# Altium project BKN-3.PrjPcb
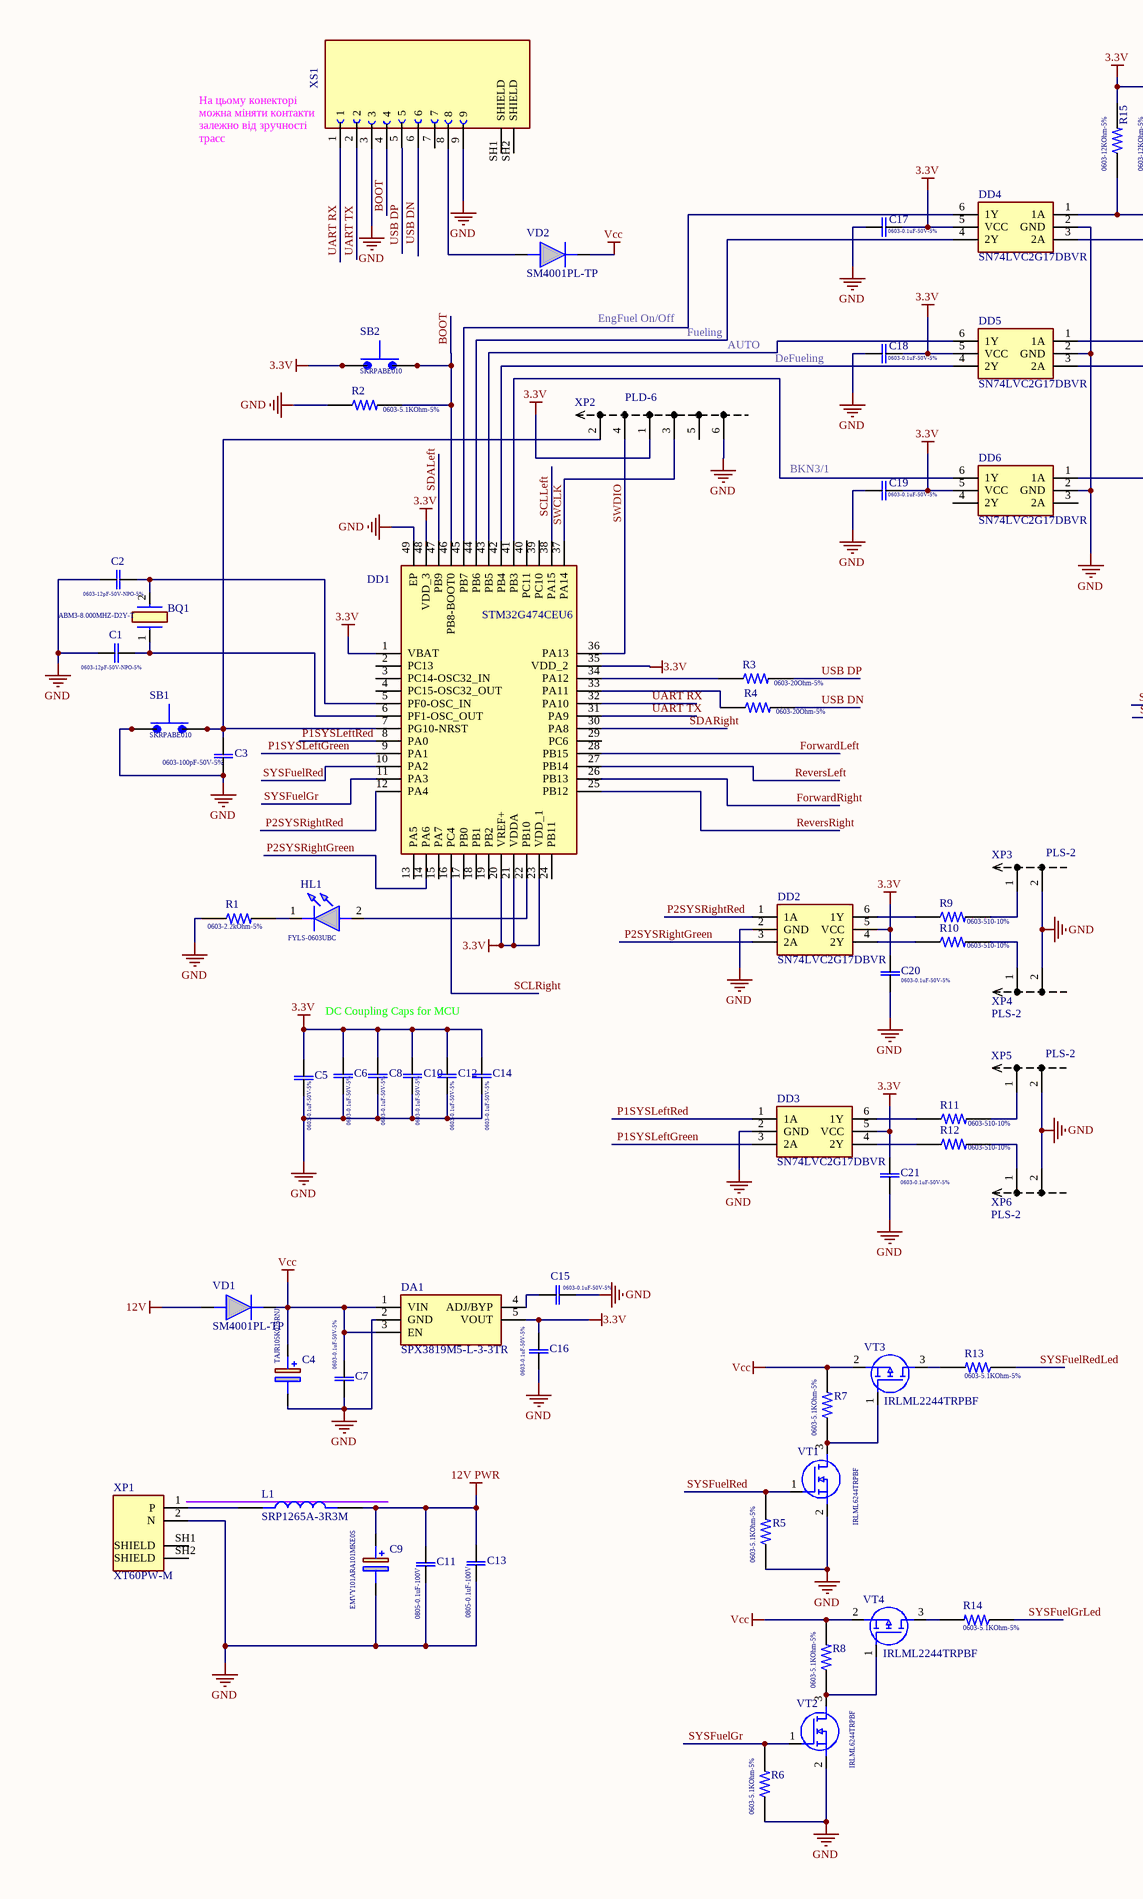
[diagram p0: BKN-3.SchDoc, left]
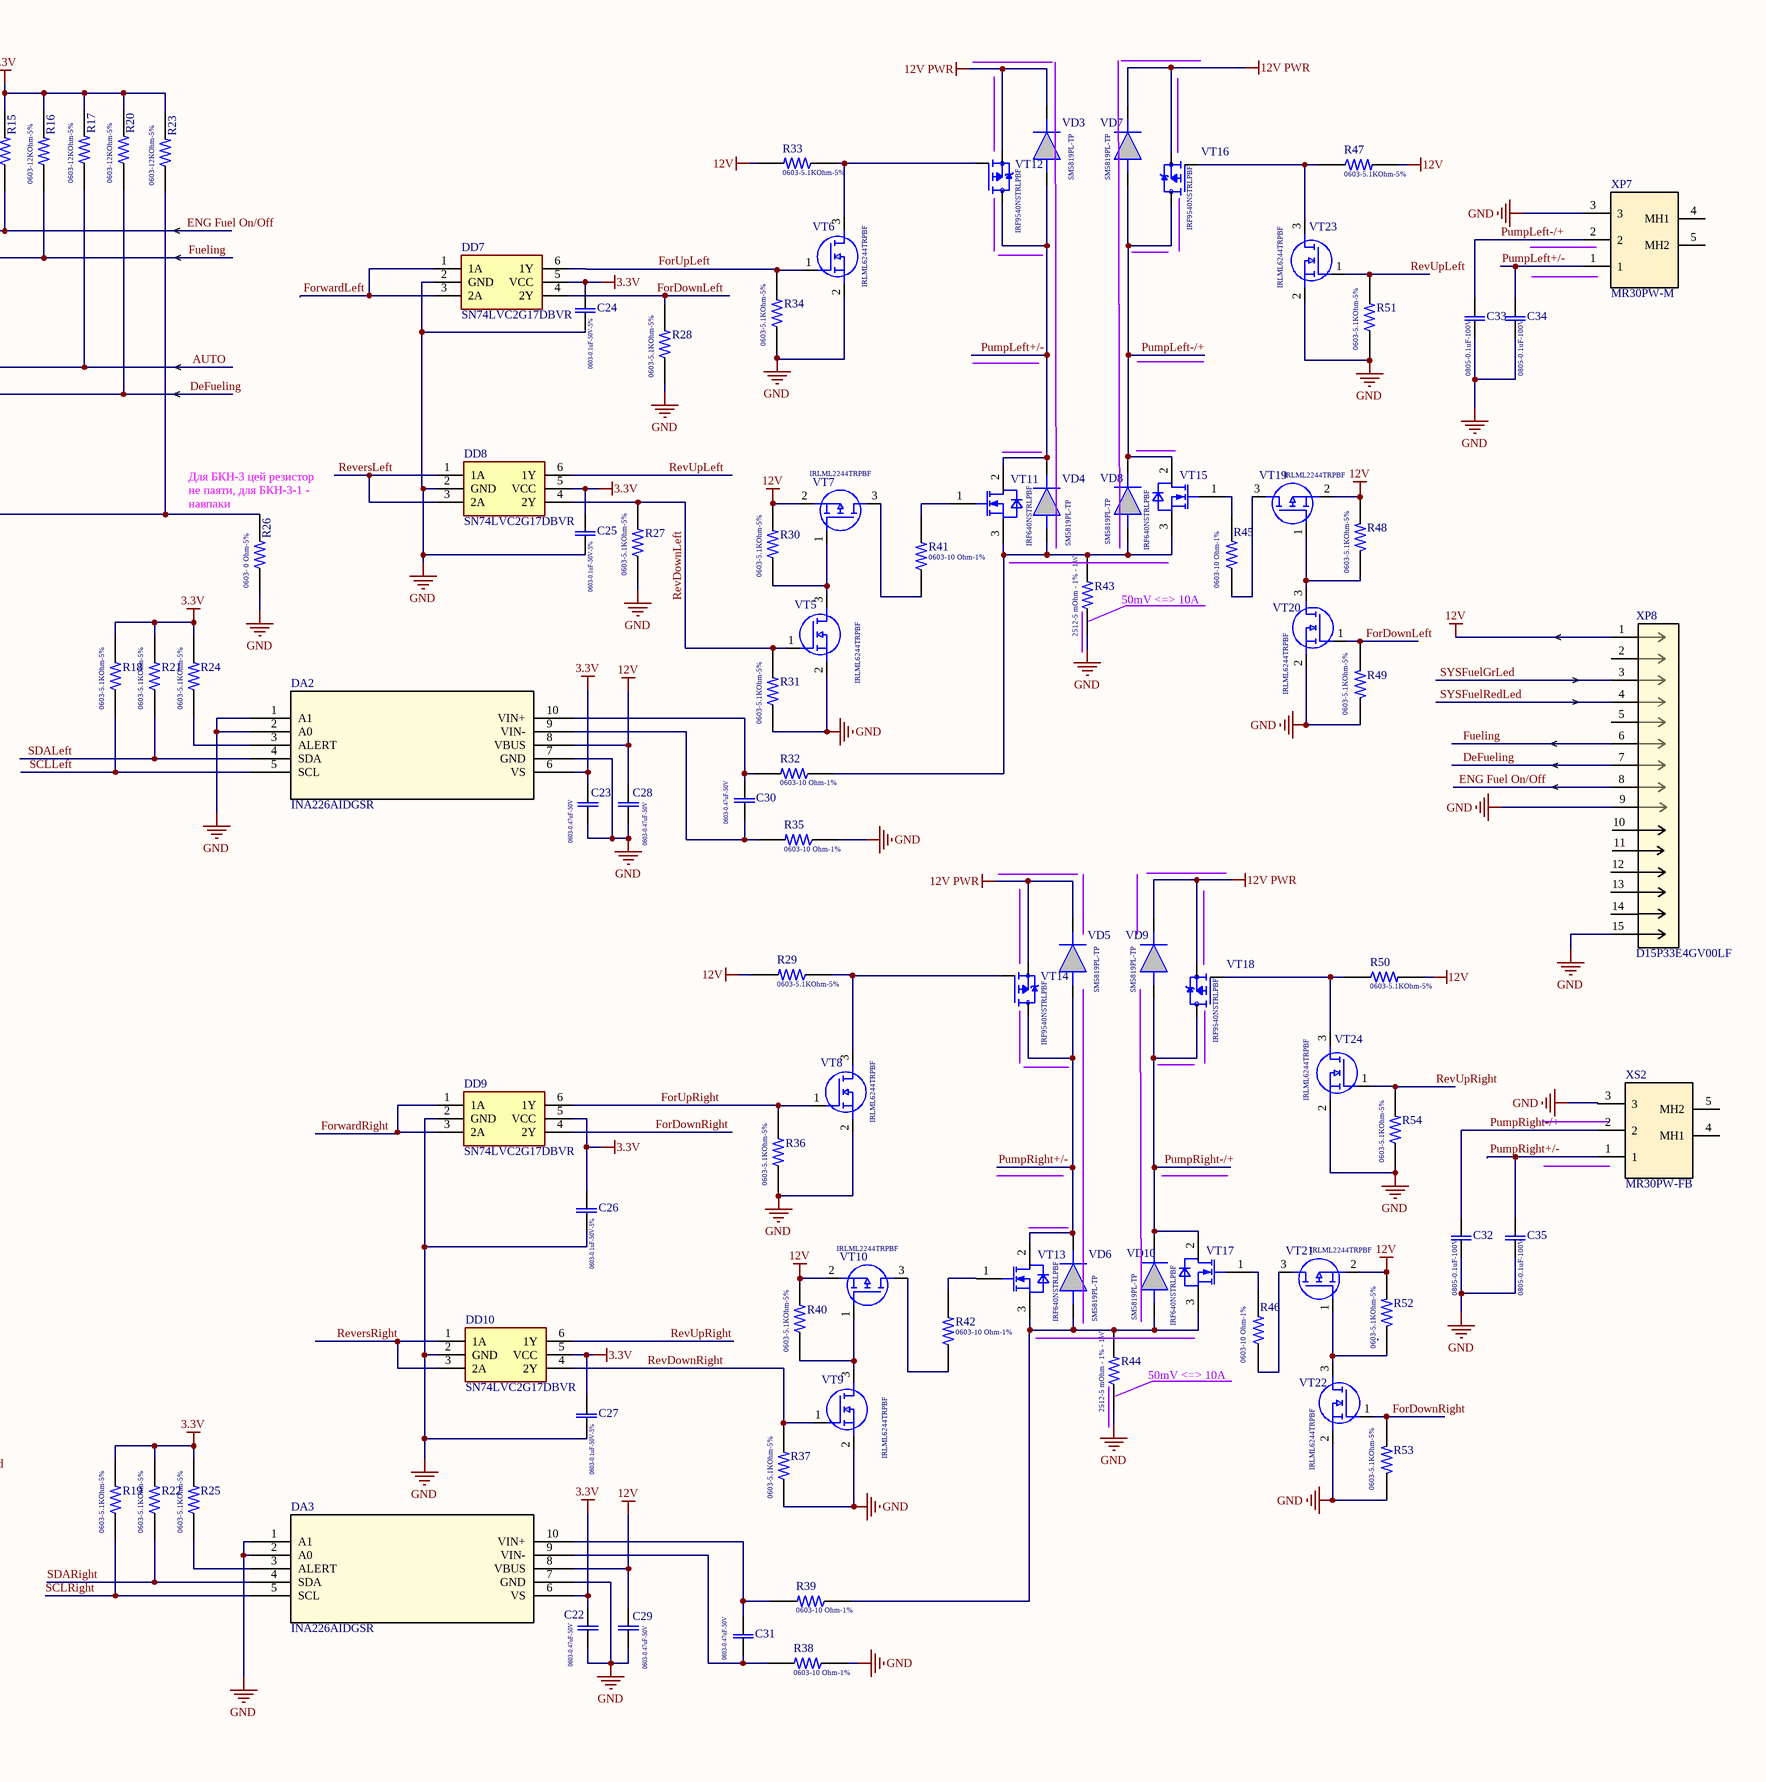
[diagram p1: BKN-3.SchDoc, right]
1 sheet, 151 parts. Net scope: global (net labels, ports and power ports of the same name join across sheets).
Board file: BKN-3.PcbDoc

## Sheet BKN-3.SchDoc
size A2

### Parts
BQ1  ABM3-8.000MHZ-D2Y-T  [ABM3-25.000MHz]
C1  0603-12pF-50V-NPO-5%  [C0603]
C2  0603-12pF-50V-NPO-5%  [C0603]
C3  0603-100pF-50V-5%  [C0603]
C4  TAJR105K025RNJ  [TAJR105K025RNJ]
C5  0603-0.1uF-50V-5%  [C0603]
C6  0603-0.1uF-50V-5%  [C0603]
C7  0603-0.1uF-50V-5%  [C0603]
C8  0603-0.1uF-50V-5%  [C0603]
C9  EMVY101ARA101MKE0S  [EMVY101ARA101MKE0S]
C10  0603-0.1uF-50V-5%  [C0603]
C11  0805-0.1uF-100V  [Cap0805]
C12  0603-0.1uF-50V-5%  [C0603]
C13  0805-0.1uF-100V  [Cap0805]
C14  0603-0.1uF-50V-5%  [C0603]
C15  0603-0.1uF-50V-5%  [C0603]
C16  0603-0.1uF-50V-5%  [C0603]
C17  0603-0.1uF-50V-5%  [C0603]
C18  0603-0.1uF-50V-5%  [C0603]
C19  0603-0.1uF-50V-5%  [C0603]
C20  0603-0.1uF-50V-5%  [C0603]
C21  0603-0.1uF-50V-5%  [C0603]
C22  0603-0.47uF-50V  [C0603]
C23  0603-0.47uF-50V  [C0603]
C24  0603-0.1uF-50V-5%  [C0603]
C25  0603-0.1uF-50V-5%  [C0603]
C26  0603-0.1uF-50V-5%  [C0603]
C27  0603-0.1uF-50V-5%  [C0603]
C28  0603-0.47uF-50V  [C0603]
C29  0603-0.47uF-50V  [C0603]
C30  0603-0.47uF-50V  [C0603]
C31  0603-0.47uF-50V  [C0603]
C32  0805-0.1uF-100V  [Cap0805]
C33  0805-0.1uF-100V  [Cap0805]
C34  0805-0.1uF-100V  [Cap0805]
C35  0805-0.1uF-100V  [Cap0805]
DA1  SPX3819M5-L-3-3TR  [SOT95P280x145-5N]
DA2  INA226AIDGSR  [INA226AIDGSR]
DA3  INA226AIDGSR  [INA226AIDGSR]
DD1  STM32G474CEU6  [QFN50P700X700X60-49N-D]
DD2  SN74LVC2G17DBVR  [SOT95P280x145-6N]
DD3  SN74LVC2G17DBVR  [SOT95P280x145-6N]
DD4  SN74LVC2G17DBVR  [SOT95P280x145-6N]
DD5  SN74LVC2G17DBVR  [SOT95P280x145-6N]
DD6  SN74LVC2G17DBVR  [SOT95P280x145-6N]
DD7  SN74LVC2G17DBVR  [SOT95P280x145-6N]
DD8  SN74LVC2G17DBVR  [SOT95P280x145-6N]
DD9  SN74LVC2G17DBVR  [SOT95P280x145-6N]
DD10  SN74LVC2G17DBVR  [SOT95P280x145-6N]
HL1  FYLS-0603UBC  [LED0603]
L1  SRP1265A-3R3M  [SRP1265A-3R3M]
R1  0603-2.2kOhm-5%  [Res0603]
R2  0603-5.1KOhm-5%  [Res0603]
R3  0603-20Ohm-5%  [Res0603]
R4  0603-20Ohm-5%  [Res0603]
R5  0603-5.1KOhm-5%  [Res0603]
R6  0603-5.1KOhm-5%  [Res0603]
R7  0603-5.1KOhm-5%  [Res0603]
R8  0603-5.1KOhm-5%  [Res0603]
R9  0603-510-10%  [Res0603]
R10  0603-510-10%  [Res0603]
R11  0603-510-10%  [Res0603]
R12  0603-510-10%  [Res0603]
R13  0603-5.1KOhm-5%  [Res0603]
R14  0603-5.1KOhm-5%  [Res0603]
R15  0603-12KOhm-5%  [Res0603]
R16  0603-12KOhm-5%  [Res0603]
R17  0603-12KOhm-5%  [Res0603]
R18  0603-5.1KOhm-5%  [Res0603]
R19  0603-5.1KOhm-5%  [Res0603]
R20  0603-12KOhm-5%  [Res0603]
R21  0603-5.1KOhm-5%  [Res0603]
R22  0603-5.1KOhm-5%  [Res0603]
R23  0603-12KOhm-5%  [Res0603]
R24  0603-5.1KOhm-5%  [Res0603]
R25  0603-5.1KOhm-5%  [Res0603]
R26  0603- 0 Ohm-5%  [Res0603]
R27  0603-5.1KOhm-5%  [Res0603]
R28  0603-5.1KOhm-5%  [Res0603]
R29  0603-5.1KOhm-5%  [Res0603]
R30  0603-5.1KOhm-5%  [Res0603]
R31  0603-5.1KOhm-5%  [Res0603]
R32  0603-10 Ohm-1%  [Res0603]
R33  0603-5.1KOhm-5%  [Res0603]
R34  0603-5.1KOhm-5%  [Res0603]
R35  0603-10 Ohm-1%  [Res0603]
R36  0603-5.1KOhm-5%  [Res0603]
R37  0603-5.1KOhm-5%  [Res0603]
R38  0603-10 Ohm-1%  [Res0603]
R39  0603-10 Ohm-1%  [Res0603]
R40  0603-5.1KOhm-5%  [Res0603]
R41  0603-10 Ohm-1%  [Res0603]
R42  0603-10 Ohm-1%  [Res0603]
R43  2512-5 mOhm - 1% - 1W  [Res2512]
R44  2512-5 mOhm - 1% - 1W  [Res2512]
R45  0603-10 Ohm-1%  [Res0603]
R46  0603-10 Ohm-1%  [Res0603]
R47  0603-5.1KOhm-5%  [Res0603]
R48  0603-5.1KOhm-5%  [Res0603]
R49  0603-5.1KOhm-5%  [Res0603]
R50  0603-5.1KOhm-5%  [Res0603]
R51  0603-5.1KOhm-5%  [Res0603]
R52  0603-5.1KOhm-5%  [Res0603]
R53  0603-5.1KOhm-5%  [Res0603]
R54  0603-5.1KOhm-5%  [Res0603]
SB1  SKRPABE010  [SKRPABE010]
SB2  SKRPABE010  [SKRPABE010]
VD1  SM4001PL-TP  [SODFL3716X120N]
VD2  SM4001PL-TP  [SODFL3716X120N]
VD3  SM5819PL-TP  [SM5819PL-TP (SOD123)]
VD4  SM5819PL-TP  [SM5819PL-TP (SOD123)]
VD5  SM5819PL-TP  [SM5819PL-TP (SOD123)]
VD6  SM5819PL-TP  [SM5819PL-TP (SOD123)]
VD7  SM5819PL-TP  [SM5819PL-TP (SOD123)]
VD8  SM5819PL-TP  [SM5819PL-TP (SOD123)]
VD9  SM5819PL-TP  [SM5819PL-TP (SOD123)]
VD10  SM5819PL-TP  [SM5819PL-TP (SOD123)]
VT1  IRLML6244TRPBF  [SOT95P230x110-3N]
VT2  IRLML6244TRPBF  [SOT95P230x110-3N]
VT3  IRLML2244TRPBF  [SOT95P237x112-3N]
VT4  IRLML2244TRPBF  [SOT95P237x112-3N]
VT5  IRLML6244TRPBF  [SOT95P230x110-3N]
VT6  IRLML6244TRPBF  [SOT95P230x110-3N]
VT7  IRLML2244TRPBF  [SOT95P237x112-3N]
VT8  IRLML6244TRPBF  [SOT95P230x110-3N]
VT9  IRLML6244TRPBF  [SOT95P230x110-3N]
VT10  IRLML2244TRPBF  [SOT95P237x112-3N]
VT11  IRF640NSTRLPBF  [IRF640NSTRLPBF]
VT12  IRF9540NSTRLPBF  [IRF9540NSTRLPBF]
VT13  IRF640NSTRLPBF  [IRF640NSTRLPBF]
VT14  IRF9540NSTRLPBF  [IRF9540NSTRLPBF]
VT15  IRF640NSTRLPBF  [IRF640NSTRLPBF]
VT16  IRF9540NSTRLPBF  [IRF9540NSTRLPBF]
VT17  IRF640NSTRLPBF  [IRF640NSTRLPBF]
VT18  IRF9540NSTRLPBF  [IRF9540NSTRLPBF]
VT19  IRLML2244TRPBF  [SOT95P237x112-3N]
VT20  IRLML6244TRPBF  [SOT95P230x110-3N]
VT21  IRLML2244TRPBF  [SOT95P237x112-3N]
VT22  IRLML6244TRPBF  [SOT95P230x110-3N]
VT23  IRLML6244TRPBF  [SOT95P230x110-3N]
VT24  IRLML6244TRPBF  [SOT95P230x110-3N]
XP1  XT60PW-M  [XT60PW-M]
XP2  PLD-6  [PLD-6]
XP3  PLS-2  [PLS-2]
XP4  PLS-2  [PLS-2]
XP5  PLS-2  [PLS-2]
XP6  PLS-2  [PLS-2]
XP7  MR30PW-M  [MR30PW-M]
XP8  D15P33E4GV00LF  [D15P33E4GV00LF (Amphenol)]
XS1  AMPHENOL_LD09S33E4GV00LF (DB9 ThrHole Right Receptacle )  [AMPHENOL_LD09S33E4GV00LF (9pin receptacle)]  (value not drawn)
XS2  MR30PW-FB  [MR30PW-FB]

### Nets
3.3V: C5.2 C6.2 C8.2 C10.2 C12.2 C14.2 C16.2 C17.1 C18.1 C19.1 C20.1 C21.1 C22.2 C23.2 C24.2 C25.2 C26.2 C27.2 DA1.5(VOUT) DA2.6(VS) DA3.6(VS) DD1.1(VBAT) DD1.20(VREF+) DD1.21(VDDA) DD1.23(VDD_1) DD1.35(VDD_2) DD1.48(VDD_3) DD2.5(VCC) DD3.5(VCC) DD4.5(VCC) DD5.5(VCC) DD6.5(VCC) DD7.5(VCC) DD8.5(VCC) DD9.5(VCC) DD10.5(VCC) R15.2 R16.2 R17.2 R18.2 R19.2 R20.2 R21.2 R22.2 R23.2 R24.2 R25.2 SB2.1 SB2.2 XP2.1
12V: C28.2 C29.2 DA2.8(VBUS) DA3.8(VBUS) R29.2 R30.2 R33.2 R40.2 R47.2 R48.2 R50.2 R52.2 VD1.2(A) VT7.2(S) VT10.2(S) VT19.2(S) VT21.2(S) XP8.1
12V PWR: C9.1(+) C11.1 C13.1 L1.2 VD3.1(K) VD5.1(K) VD7.1(K) VD9.1(K) VT12.3(S) VT14.3(S) VT16.3(S) VT18.3(S)
GND: C1.2 C2.2 C3.1 C4.2(-) C5.1 C6.1 C7.1 C8.1 C9.2(-) C10.1 C11.2 C12.1 C13.2 C14.1 C15.1 C16.1 C17.2 C18.2 C19.2 C20.2 C21.2 C22.1 C23.1 C24.1 C25.1 C26.1 C27.1 C28.1 C29.1 C32.2 C33.2 C34.2 C35.2 DA1.2(GND) DA2.1(A1) DA2.2(A0) DA2.7(GND) DA3.1(A1) DA3.2(A0) DA3.7(GND) DD1.49(EP) DD2.2(GND) DD3.2(GND) DD4.2(GND) DD5.2(GND) DD6.2(GND) DD7.2(GND) DD8.2(GND) DD9.2(GND) DD10.2(GND) R1.1 R2.1 R5.1 R6.1 R26.1 R27.1 R28.1 R31.1 R34.1 R35.1 R36.1 R37.1 R38.1 R43.1 R44.1 R49.1 R51.1 R53.1 R54.1 SB1.1 SB1.2 VT1.2(S) VT2.2(S) VT5.2(S) VT6.2(S) VT8.2(S) VT9.2(S) VT20.2(S) VT22.2(S) VT23.2(S) VT24.2(S) XP1.2(N) XP2.6 XP3.2 XP4.2 XP5.2 XP6.2 XP7.3 XP8.9 XP8.15 XS1.3 XS1.9 XS2.3
Vcc: C4.1(+) C7.2 DA1.1(VIN) DA1.3(EN) R7.2 R8.2 VD1.1(K) VD2.1(K) VT3.2(S) VT4.2(S)
AUTO: DD5.1(1A) R17.1
BOOT: DD1.46(PB8-BOOT0) R2.2 SB2.3 SB2.4 XS1.4
DeFueling: DD5.3(2A) R20.1 XP8.7
ENG Fuel On/Off: DD4.1(1A) R15.1 XP8.8
ForDownLeft: DD7.4(2Y) R28.2 R49.2 VT20.1(G)
ForDownRight: DD9.4(2Y) R53.2 VT22.1(G)
ForUpLeft: DD7.6(1Y) R34.2 VT6.1(G)
ForUpRight: DD9.6(1Y) R36.2 VT8.1(G)
ForwardLeft: DD1.28(PB15) DD7.1(1A) DD7.3(2A)
ForwardRight: DD1.26(PB13) DD9.1(1A) DD9.3(2A)
Fueling: DD4.3(2A) R16.1 XP8.6
P1SYSLeftGreen: DD1.9(PA1) DD3.3(2A)
P1SYSLeftRed: DD1.8(PA0) DD3.1(1A)
P2SYSRightGreen: DD1.14(PA6) DD2.3(2A)
P2SYSRightRed: DD1.12(PA4) DD2.1(1A)
PumpLeft+/-: C34.1 VD3.2(A) VD4.1(K) VT11.2(2,4) VT12.4(D) XP7.1
PumpLeft-/+: C33.1 VD7.2(A) VD8.1(K) VT15.2(2,4) VT16.4(D) XP7.2
PumpRight+/-: C35.1 VD5.2(A) VD6.1(K) VT13.2(2,4) VT14.4(D) XS2.1
PumpRight-/+: C32.1 VD9.2(A) VD10.1(K) VT17.2(2,4) VT18.4(D) XS2.2
RevDownLeft: DD8.4(2Y) R27.2 R31.2 VT5.1(G)
RevDownRight: DD10.4(2Y) R37.2 VT9.1(G)
ReversLeft: DD1.27(PB14) DD8.1(1A) DD8.3(2A)
ReversRight: DD1.25(PB12) DD10.1(1A) DD10.3(2A)
RevUpLeft: DD8.6(1Y) R51.2 VT23.1(G)
RevUpRight: DD10.6(1Y) R54.2 VT24.1(G)
SCLLeft: DA2.5(SCL) DD1.38(PA15) R18.1
SCLRight: DA3.5(SCL) DD1.16(PC4) R19.1
SDALeft: DA2.4(SDA) DD1.47(PB9) R21.1
SDARight: DA3.4(SDA) DD1.30(PA8) R22.1
SYSFuelGr: DD1.11(PA3) R6.2 VT2.1(G)
SYSFuelGrLed: R14.1 XP8.3
SYSFuelRed: DD1.10(PA2) R5.2 VT1.1(G)
SYSFuelRedLed: R13.1 XP8.4
UART RX: DD1.32(PA10) XS1.1
UART TX: DD1.31(PA9) XS1.2
USB DN: R4.2 XS1.6
USB DP: R3.2 XS1.5
NetBQ1_1: BQ1.1 C1.1 DD1.6(PF1-OSC_OUT)
NetBQ1_2: BQ1.2 C2.1 DD1.5(PF0-OSC_IN)
NetC3_2: C3.2 DD1.7(PG10-NRST) SB1.3 SB1.4 XP2.2
NetC15_2: C15.2 DA1.4(ADJ/BYP)
NetC30_1: C30.1 DA2.9(VIN-) R35.2
NetC30_2: C30.2 DA2.10(VIN+) R32.2
NetC31_1: C31.1 DA3.9(VIN-) R38.2
NetC31_2: C31.2 DA3.10(VIN+) R39.2
NetDA2_3: DA2.3(ALERT) R24.1
NetDA3_3: DA3.3(ALERT) R25.1
NetDD1_22: DD1.22(PB10) HL1.2(A)
NetDD1_33: DD1.33(PA11) R4.1
NetDD1_34: DD1.34(PA12) R3.1
NetDD1_36: DD1.36(PA13) XP2.4
NetDD1_37: DD1.37(PA14) XP2.3
NetDD1_41: DD1.41(PB3) DD6.6(1Y)
NetDD1_42: DD1.42(PB4) DD5.4(2Y)
NetDD1_43: DD1.43(PB5) DD5.6(1Y)
NetDD1_44: DD1.44(PB6) DD4.4(2Y)
NetDD1_45: DD1.45(PB7) DD4.6(1Y)
NetDD2_4: DD2.4(2Y) R10.1
NetDD2_6: DD2.6(1Y) R9.1
NetDD3_4: DD3.4(2Y) R12.1
NetDD3_6: DD3.6(1Y) R11.1
NetDD6_1: DD6.1(1A) R23.1 R26.2
NetHL1_1: HL1.1(K) R1.2
NetL1_1: L1.1 XP1.1(P)
NetR7_1: R7.1 VT1.3(D) VT3.1(G)
NetR8_1: R8.1 VT2.3(D) VT4.1(G)
NetR9_2: R9.2 XP3.1
NetR10_2: R10.2 XP4.1
NetR11_2: R11.2 XP5.1
NetR12_2: R12.2 XP6.1
NetR13_2: R13.2 VT3.3(D)
NetR14_2: R14.2 VT4.3(D)
NetR29_1: R29.1 VT8.3(D) VT14.1(G)
NetR30_1: R30.1 VT5.3(D) VT7.1(G)
NetR32_1: R32.1 R43.2 VD4.2(A) VD8.2(A) VT11.3(SOURCE) VT15.3(SOURCE)
NetR33_1: R33.1 VT6.3(D) VT12.1(G)
NetR39_1: R39.1 R44.2 VD6.2(A) VD10.2(A) VT13.3(SOURCE) VT17.3(SOURCE)
NetR40_1: R40.1 VT9.3(D) VT10.1(G)
NetR41_1: R41.1 VT7.3(D)
NetR41_2: R41.2 VT11.1(GATE)
NetR42_1: R42.1 VT10.3(D)
NetR42_2: R42.2 VT13.1(GATE)
NetR45_1: R45.1 VT19.3(D)
NetR45_2: R45.2 VT15.1(GATE)
NetR46_1: R46.1 VT21.3(D)
NetR46_2: R46.2 VT17.1(GATE)
NetR47_1: R47.1 VT16.1(G) VT23.3(D)
NetR48_1: R48.1 VT19.1(G) VT20.3(D)
NetR50_1: R50.1 VT18.1(G) VT24.3(D)
NetR52_1: R52.1 VT21.1(G) VT22.3(D)
NetVD2_2: VD2.2(A) XS1.8

Not connected (* = marked no-connect by the designer): DD1 2(PC13) 3(PC14-OSC32_IN) 4(PC15-OSC32_OUT) 13(PA5) 15(PA7) 17(PB0) 18(PB1) 19(PB2) 24(PB11) 29(PC6) 39(PC10) 40(PC11); DD6 3(2A) 4(2Y); XP1 SH1(SHIELD) SH2(SHIELD); XP2 5; XP7 4(MH1) 5(MH2); XP8 2 5 10 11 12 13 14; XS1 7 SH1(SHIELD) SH2(SHIELD); XS2 4(MH1) 5(MH2)

### Notes on the sheet
- (near XS1) На цьому конекторі можна міняти контакти залежно від зручності трасс
- EngFuel On/Off
- Fueling
- AUTO
- DeFueling
- (near DD1) SWCLK
- SWDIO
- BKN3/1
- (near R26) Для БКН-3 цей резистор не паяти, для БКН-3-1 - навпаки
- 50mV <=> 10A
- DC Coupling Caps for MCU
- Title
- Size:
- Date:
- File:
- A2
- Number:
- Time:
- Revision:
- Sheet
- of

### Library data of the parts
BQ1 = ABM3-25.000MHz: ABM3-8.000MHZ-D2Y-T Кварцевий резонатор Космодром код товару: 00-00066552 Виробник:ABRACON
C1 C2 = CAP0603: Чіп кераміка (0603) 12pf (NP0) 50v ± 5% / SMD-конденсатор / Конденсатор керамический, SMD 0603, номинальная емкость: 12pF, номинальное напряжение: 50V, точность +/-5% CL10C120JB8NNNC / Тип корпуса: CAP0603 / Производитель: SAMSUNG / Космодром код товара: 00-00034389
C3 = CAP0603: Чіп кераміка (0603) 100pf (NP0) 50v ± 5% / SMD-конденсатор / Конденсатор керамический, SMD 0603, номинальная емкость: 100pF, номинальное напряжение: 50V, точность +/-5% CL10C101JB8NNNC / Тип корпуса: CAP0603 / Производитель: SAMSUNG / Космодром код товара: 00-00034408
C4 = TAJR105K025RNJ: TAJR105K025RNJ / Танталовый конденсатор SMD / Конденсатор: танталовый: SMD: 1мкФ: 25В: Корп: R,0805: ±10% / Производитель: AVX / Космодром код товара: 00-00052187
C5 C6 C8 C10 C12 C14-C21 C24-C27 = CAP0603: / Чіп кераміка (0603) 0,1mkf (X7R) 50v ±10% / SMD-конденсатор 0603 / Конденсатор керамический, SMD 0603, номинальная емкость: 100nF, номинальное напряжение: 50V, точность +/-10% CL10B104KB8NNNC / Тип корпуса: CAP0603 / Производитель: SAMSUNG / Космодром код товара: 00-00052755
C7 = CAP0603: / Чіп кераміка (0603) 0,1mkf (X7R) 50v ±10% / SMD-конденсатор 0603 / Конденсатор керамический, SMD 0603, номинальная емкость: 100nF, номинальное напряжение: 50V, точность +/-10% CL10B104KB8NNNC / Тип корпуса: CAP0603 / Производитель: SAMSUNG / код товара: 00-00052755
C9 = EMVY101ARA101MKE0S: EMVY101ARA101MKE0S / DigiKey Part Number / 565-2511-2-ND - Tape & Reel (TR) / 565-2511-1-ND - Cut Tape (CT) / 565-2511-6-ND - Digi-Reel® / Manufacturer / Chemi-Con / Manufacturer Product Number / EMVY101ARA101MKE0S / Description / CAP ALUM 100UF 20% 100V SMD
C11 C13 C32-C35 = Cap0805: GCM21BR72A104KA37L / SMD-конденсатор / Конденсатор керамический 100 В, 0.1 мкФ ±10%, X7R, SMD 0805, -55...125 °C / Тип корпуса: CAP0805 / Производитель: MURATA / код товара: 00-00068052
C22 C23 C28-C31 = CAP0603: Чіп кераміка (0603) 0,47mkf (X5R) 50v ± 10% / SMD-конденсатор / Конденсатор керамический, SMD 0603, номинальная емкость: 470nF, номинальное напряжение: 50V, точность +/-10% CL10A474KB8NNNC / Тип корпуса: CAP0603 / Производитель: SAMSUNG / Космодром код товара: 00-00073511
DA1 = SPX3819M5-L-3-3TR: SPX3819M5-L-3-3/TR / Стабилизатор напряжения / LDO регуляторы напряжения 500mA / Тип корпуса: SOT23-5 / Производитель: MaxLinear / Космодром код товара: 00-00071004
DA2 DA3 = INA226AIDGSR: Мікросхема INA226AIDGSR / Двонаправлений монітор струму/потужності з інтерфейсом I2CМікросхема INA226AIDGSR / Корпус: 10-MSOP / Виробник: Texas Instruments (TI)  https://voron.ua/
DD1 = STM32G474CEU6: STM32G474CEU6 / Виробник: / STMicroelectronics / IC MCU 32BIT 512KB FLSH 48UFQFPN VD MAIS
DD2-DD10 = SN74LVC2G17DBVR: SN74LVC2G17DBVR / Микросхема серии 74LVC / Буфер, триггер Шмитта, 1.65В до 5.5В, SOT-23-6 / Тип корпуса: SOT23-6 / Производитель: TI / Космодром код товара: 00-00023488
HL1 = LED0603: FYLS-0603UBC / Светодиод SMD / Светодиод 0603. Синий ,120mcd 130°, 468nm. 3,3 В. 20 мА. / Производитель: FORYARD / Космодром код товара: 00-00055962
R1 = Res0603: SMD-резистор (0603) 2,2 kom ±5% / SMD-резистор 0603 / SMD-резистор 0603, Номинальная мощность: 0,1 Вт, Номинальное сопротивление: 2,2 кОм, Допустимое отклонение +/- 5% RC0603JR-072K2L / Тип корпуса: RC0603 / Производитель: YAGEO / Космодром код товара: 00-00033888
R2 = Res0603: SMD-резистор (0603) 5,1 kom ±5% / SMD-резистор 0603 / SMD-резистор 0603, Номинальная мощность: 0,1 Вт, Номинальное сопротивление: 5,1 кОм, Допустимое отклонение +/- 5% RC0603JR-075K1L / Тип корпуса: RC0603 / Производитель: YAGEO / Космодром код товара: 00-00033897
R3 R4 = Res0603: SMD-резистор (0603) 20 om ±5% / SMD-резистор 0603 / SMD-резистор 0603, Номинальная мощность: 0,1 Вт, Номинальное сопротивление: 20 Ом, Допустимое отклонение +/- 5% / Тип корпуса: RC0603 / Производитель: Faithful Link / код товара: 00-00033844 / Тип корпуса: RC0603 / Производитель: YAGEO / код товара: 00-00033897 / Тип корпуса: RC0603 / Производитель: YAGEO / код товара: 00-00033885
R5-R8 R13 R14 R18 R19 R21 R22 R24 R25 R27-R31 R33 R34 R36 R37 R40 R47-R54 = Res0603: SMD-резистор (0603) 5,1 kom ±5% / SMD-резистор 0603 / SMD-резистор 0603, Номинальная мощность: 0,1 Вт, Номинальное сопротивление: 5,1 кОм, Допустимое отклонение +/- 5% RC0603JR-075K1L / Тип корпуса: RC0603 / Производитель: YAGEO / код товара: 00-00033897
R9-R12 = Res0603: SMD-резистор (0603) 510 om ±5% / RC0603JR-07510RL / Производитель: YAGEO Космодром / код товара: 00-00033875
R15-R17 R20 R23 = Res0603: SMD-резистор (0603) 12 kom ±5% / SMD-резистор / SMD-резистор 0603, Номинальная мощность: 0,1 Вт, Номинальное сопротивление: 12 кОм, Допустимое отклонение +/- 5% RC0603JR-0712KL / Тип корпуса: RC0603 / Производитель: YAGEO / код товара: 00-00033906
R26 = Res0603: MD-резистор (0603) 0 om ±5% / SMD-резистор / SMD-резистор 0603, Номинальная мощность: 0,1 Вт, Номинальное сопротивление: 0 Ом, Допустимое отклонение +/- 5% RC0603JR-070RL / Тип корпуса: RC0603 / Производитель: YAGEO / код товара: 00-00033814
R32 R35 R38 R39 R41 R42 R45 R46 = Res0603: SMD-резистор (0603) 10 om ±1% (точні) / SMD-резистор / SMD-резистор 0603, Номинальная мощность: 0,1 Вт, Номинальное сопротивление: 10 Ом, Допустимое отклонение +/- 1% RC0603FR-0710RL / Тип корпуса: RC0603-1P / Производитель: YAGEO / код товара: 00-00059987
R43 R44 = Res2512: RMF2512FTR005 / SMD-резистор / Токочутливий резистор 1%, 1 Вт, 0,005 Ом / Производитель: Faithful Link / код товара: 00-00070851
SB1 SB2 = SKRPABE010: SKRPABE010 / Кнопка тактовая / Микропереключатель TACT, SPST, Пол: 2, 0,05A/16ВDC, SMT, 1,6Н, SKRP / Производитель: ALPS / Космодром код товара: 00-00078837
VD1 = SM4001PL-TP: Производитель: MCC / Тип корпуса: SOD-123 / Космодром код товара: 00-00072425
VD2 = SM4001PL-TP: Диод / SM4007PL-TP / Выпрямители 1A, 1000V 1A, 1000V / На складе ... / Производитель: MCC / Тип корпуса: SOD-123 / Космодром код товара: 00-00072425
VD3-VD10 = SM5819PL-TP: SM5819PL / Imrad Артикул: 195754 / Производитель: MCC / Корпус: SOD-123
VT1 VT2 VT5 VT6 VT8 VT9 VT20 VT22-VT24 = IRLML6244: IRLML6244TRPBF / Транзистор полевой MOSFET / 20V Single N-Channel HEXFET Power MOSFET in a Micro 3 package / Тип корпуса: SOT23-3 / Производитель: INFIN / Космодром код товара: 00-00032383
VT3 VT4 VT7 VT10 VT19 VT21 = IRLML2244: IRLML2244TRPBF / Транзистор полевой MOSFET / MOSFET P-CH 20V 4.3A SOT23 / Тип корпуса: SOT23-3 / Производитель: INFIN / Космодром код товара: 00-00032376
XP1 = XT60PW-M: XT60PW-M / Разъем питания / Разъем питания XT60 угловой (папа).Ток до 60А. Цвет: желтый / Производитель: AMASS / Космодром код товара: 00-00061016
XP2 = PLD-6: ZL202-20G / Разъем штыревого соединения / Планка штыревая на плату прямая шаг 2,54мм 2x10, материал контактов - позолота. Обозначение производителя: DS1021-2*10SF11 / Производитель: CONNFLY / Космодром код товара: 00-00040633
XP7 = MR30PW-M: MR30PW-M / Imrad Артикул: 393200 / Виробник: AMASS / Наявність: В наявності
XP8 = D15P33E4GV00LF: DRB-15MA / Imrad Артикул: 201593 / Назва виробника: DS1037-15MNAKT74-0CC / Виробник: CONNFLY
XS1 = AMPHENOL_LD09S33E4GV00LF (DB9 ThrHole Right Receptacle ): DHP8-09F / D-SUB коннектор / Розетка угловая на плату 9 пин. DS1037-09F / Производитель: CONNFLY / Космодром код товара: 00-00040335
XS2 = MR30PW-FB: MR30PW-FB / Imrad Артикул: 393199 / Виробник: AMASS / Наявність: В наявності